# Altium project HHO_DRIVE_V1.PrjPCB
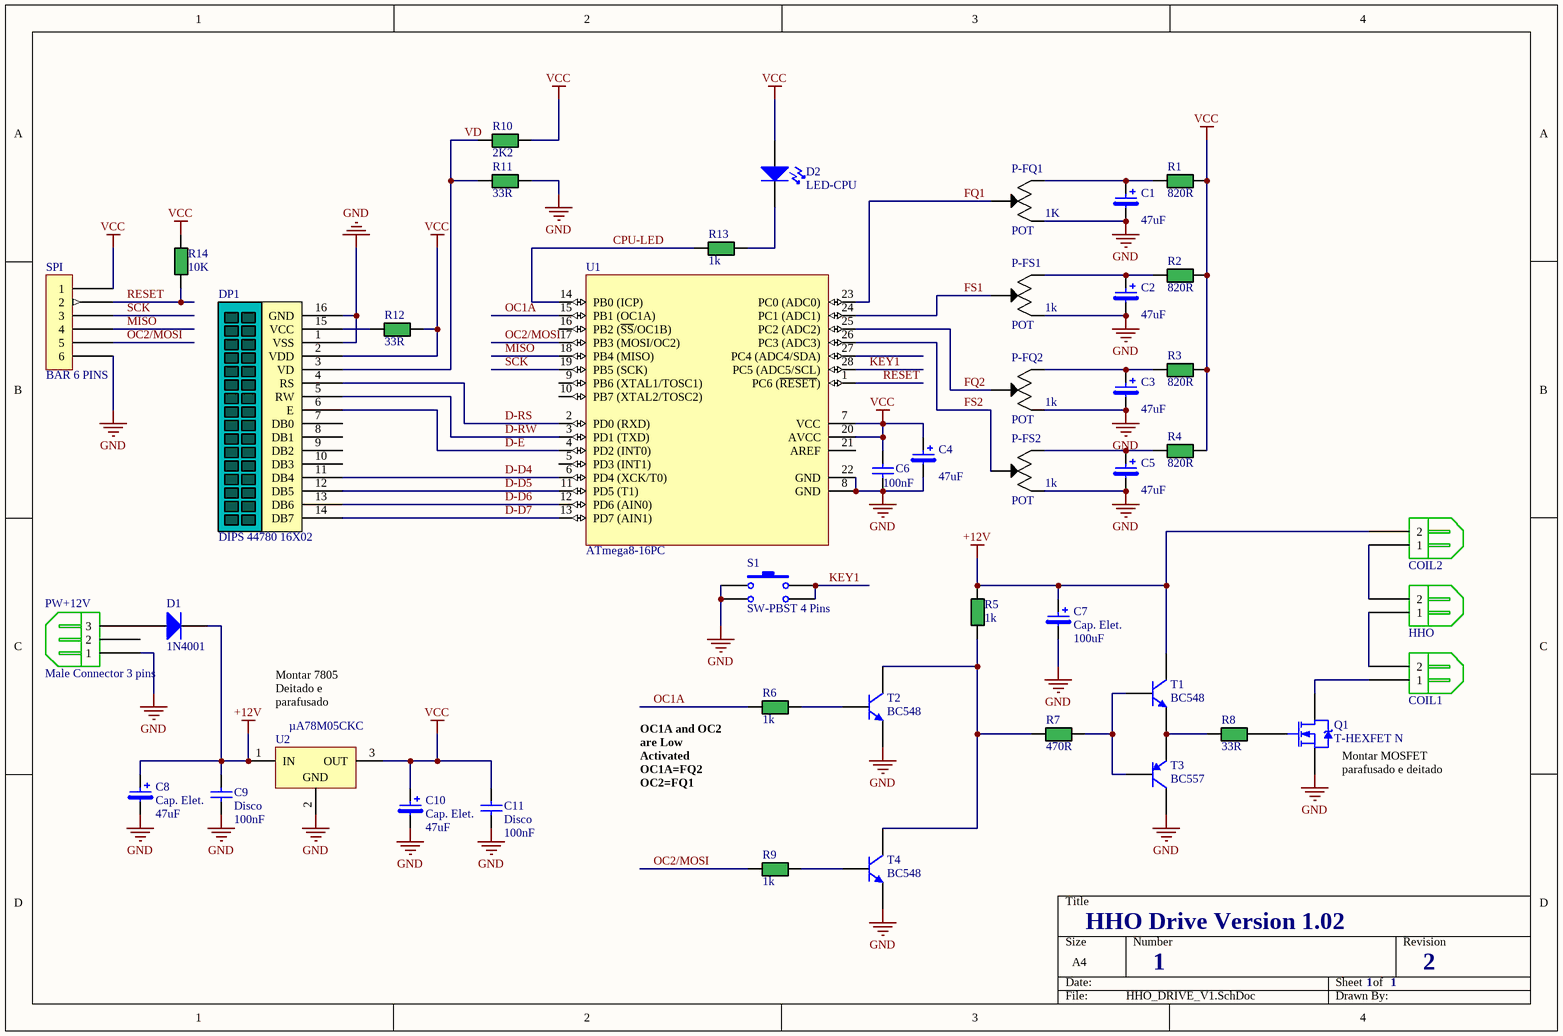
[diagram p0: HHO_DRIVE_V1.SchDoc]
1 sheet, 45 parts. Net scope: global (net labels, ports and power ports of the same name join across sheets).
Board file: HHO_DRIVE_V1.PcbDoc

## Sheet HHO_DRIVE_V1.SchDoc: HHO DIGITAL DRIVE V1.0
size A4; DocumentNumber: 1; Revision: 7; SheetNumber: 1; SheetTotal: 1; ProjectName: HHO DRIVE

### Parts
C1  value 47uF  [CAP ELE RAD 11mm H]  (hidden comment: Cap. Elet.)
C2  value 47uF  [CAP ELE RAD 11mm H]  (hidden comment: Cap. Elet.)
C3  value 47uF  [CAP ELE RAD 11mm H]  (hidden comment: Cap. Elet.)
C4  value 47uF  [CAP ELE RAD 11mm H]  (hidden comment: Cap. Elet.)
C5  value 47uF  [CAP ELE RAD 11mm H]  (hidden comment: Cap. Elet.)
C6  value 100nF  [CAP CER DISK 5MM]  (hidden comment: Disco)
C7  Cap. Elet.  value 100uF  [CAP ELE RAD 11mm H]
C8  Cap. Elet.  value 47uF  [CAP ELE RAD 11mm H]
C9  Disco  value 100nF  [CAP CER DISK 5MM]
C10  Cap. Elet.  value 47uF  [CAP ELE RAD 11mm H]
C11  Disco  value 100nF  [CAP CER DISK 5MM]
COIL1  Male Connector 2 pins  [BR102A]  (value not drawn)
COIL2  Male Connector 2 pins  [BR102A]  (value not drawn)
D1  1N4001  [DO-41]
D2  LED-CPU  [LED Red 3mm]
DP1  DIPS 44780 16X02  [Display 44780 16x02 com conector]
HHO  Male Connector 2 pins  [BR102A]  (value not drawn)
P-FQ1  POT  value 1K  [POT 200MIL/400MIL]
P-FQ2  POT  value 1k  [POT 200MIL/400MIL]
P-FS1  POT  value 1k  [POT 200MIL/400MIL]
P-FS2  POT  value 1k  [POT 200MIL/400MIL]
PW+12V  Male Connector 3 pins  [BR103A]
Q1  T-HEXFET N  [TO218 - DEITADO]
R1  value 820R  [RES 300 CR25]  (hidden comment: Resistor Generic)
R2  value 820R  [RES 300 CR25]  (hidden comment: Resistor Generic)
R3  value 820R  [RES 300 CR25]  (hidden comment: Resistor Generic)
R4  value 820R  [RES 300 CR25]  (hidden comment: Resistor Generic)
R5  value 1k  [RES 300 CR25]  (hidden comment: Resistor Generic)
R6  value 1k  [RES 300 CR25]  (hidden comment: Resistor Generic)
R7  value 470R  [RES 300 CR25]  (hidden comment: Resistor Generic)
R8  value 33R  [RES 300 CR25]  (hidden comment: Resistor Generic)
R9  value 1k  [RES 300 CR25]  (hidden comment: Resistor Generic)
R10  value 2K2  [RES 300 CR25]  (hidden comment: Resistor Generic)
R11  value 33R  [RES 300 CR25]  (hidden comment: Resistor Generic)
R12  value 33R  [RES 300 CR25]  (hidden comment: Resistor Generic)
R13  value 1k  [RES 300 CR25]  (hidden comment: Resistor Generic)
R14  value 10K  [RES 300 CR25]  (hidden comment: Resistor Generic)
S1  SW-PBST 4 Pins  [SW-PBST 4 Pins - SKHH 17 mm]
SPI  BAR 6 PINS  [HEADER BAR 6 PINS]
T1  value BC548  [TO-92 - Large]  (hidden comment: Transistor)
T2  value BC548  [TO-92 - Large]  (hidden comment: Transistor)
T3  value BC557  [TO-92 - Large]  (hidden comment: Transistor)
T4  value BC548  [TO-92 - Large]  (hidden comment: Transistor)
U1  ATmega8-16PC  [28P3]
U2  µA78M05CKC  [KC03 - Deitado]

### Nets
+12V: C7.1 C8.1 C9.2 COIL2.2 D1.2(K) R5.2 T1.3(C) U2.1(IN)
GND: C1.2 C2.2 C3.2 C4.2 C5.2 C6.1 C7.2 C8.2 C9.1 C10.2 C11.1 DP1.1(VSS) DP1.16(GND) P-FQ1.1 P-FQ2.1 P-FS1.1 P-FS2.1 PW+12V.1 Q1.3(S) R11.2 S1.1 S1.2 SPI.6 T2.1(E) T3.3(C) T4.1(E) U1.8(GND) U1.22(GND) U2.2(GND)
VCC: C4.1 C6.2 C10.1 C11.2 D2.A DP1.2(VDD) R1.2 R2.2 R3.2 R4.2 R10.2 R12.2 R14.2 SPI.1 U1.7(VCC) U1.20(AVCC) U2.3(OUT)
CPU-LED: R13.1 U1.14(PB0_(ICP))
D-D4: DP1.11(DB4) U1.6(PD4_(XCK/T0))
D-D5: DP1.12(DB5) U1.11(PD5_(T1))
D-D6: DP1.13(DB6) U1.12(PD6_(AIN0))
D-D7: DP1.14(DB7) U1.13(PD7_(AIN1))
D-E: DP1.6(E) U1.4(PD2_(INT0))
D-RS: DP1.4(RS) U1.2(PD0_(RXD))
D-RW: DP1.5(RW) U1.3(PD1_(TXD))
FQ1: P-FQ1.2 U1.23(PC0_(ADC0))
FQ2: P-FQ2.2 U1.25(PC2_(ADC2))
FS1: P-FS1.2 U1.24(PC1_(ADC1))
FS2: P-FS2.2 U1.26(PC3_(ADC3))
KEY1: S1.3 S1.4 U1.28(PC5_(ADC5/SCL))
MISO: SPI.4 U1.18(PB4_(MISO))
OC1A: R6.1 U1.15(PB1_(OC1A))
OC2/MOSI: R9.1 SPI.5 U1.17(PB3_(MOSI/OC2))
RESET: R14.1 SPI.2 U1.1(PC6_(~{RESET}))
SCK: SPI.3 U1.19(PB5_(SCK))
VD: DP1.3(VD) R10.1 R11.1
NetC1_1: C1.1 P-FQ1.3 R1.1
NetC2_1: C2.1 P-FS1.3 R2.1
NetC3_1: C3.1 P-FQ2.3 R3.1
NetC5_1: C5.1 P-FS2.3 R4.1
NetCOIL1_1: COIL1.1 Q1.2(D)
NetCOIL1_2: COIL1.2 HHO.1
NetCOIL2_1: COIL2.1 HHO.2
NetD1_1: D1.1(A) PW+12V.3
NetD2_K: D2.K R13.2
NetDP1_15: DP1.15(VCC) R12.1
NetQ1_1: Q1.1(G) R8.2
NetR5_1: R5.1 R7.1 T2.3(C) T4.3(C)
NetR6_2: R6.2 T2.2(B)
NetR7_2: R7.2 T1.2(B) T3.2(B)
NetR8_1: R8.1 T1.1(E) T3.1(E)
NetR9_2: R9.2 T4.2(B)

Not connected (* = marked no-connect by the designer): DP1 7(DB0) 8(DB1) 9(DB2) 10(DB3); PW+12V 2; U1 5(PD3_(INT1)) 9(PB6_(XTAL1/TOSC1)) 10(PB7_(XTAL2/TOSC2)) 16(PB2_(~{SS}/OC1B)) 21(AREF) 27(PC4_(ADC4/SDA))

### Notes on the sheet
- Montar 7805 Deitado e parafusado
- (near R6) OC1A and OC2 are Low Activated
  OC1A=FQ2
  OC2=FQ1
- (near Q1) Montar MOSFET parafusado e deitado
- HHO Drive Version 1.02
- 1
- 1      1
- 2
- Title
- Size:
- Date:
- A4
- Number:
- Time:
- Revision:
- Sheet
- of
- File:

### Library data of the parts
C1-C5 C7 C8 C10 = CAP_RADIAL_ELETROLITICO: Capacitor Radial Eletrolitico
C6 C9 C11 = CAP_DISCO: SMD Capacitor 1210 size
COIL1 COIL2 HHO = Male Con 2 Pin
D1 = Diode 1N4001: 1 Amp General Purpose Rectifier; Published: 8-Jun-2000; LatestRevisionDate: 17-Jul-2002; LatestRevisionNote: Re-released for DXP Platform.; DatasheetDocument: 1998; PackageDocument: Aug-1999; PackageReference: DO-41; Publisher: Altium Limited; Code_JEDEC: DO-204-AL; ComponentLink1Description: Manufacturer Link; ComponentLink1URL: http://www.fairchildsemi.com/; ComponentLink2Description: Datasheet; ComponentLink2URL: http://www.fairchildsemi.com/ds/1N%2F1N4001.pdf
D2 = LED
DP1 = Display 44780 16x02 com conector 16 pinos
P-FQ1 P-FQ2 P-FS1 P-FS2 = POT: Potenciometer 3 pins
PW+12V = Male Con 3 Pin
Q1 = T-HEXFET N: HEXFET Power MOSFET
R1-R14 = Resistor Generic: Generic Resistor
S1 = SW-PBST 4 Pins SKHH: Published: 24-Mar-1999; LatestRevisionDate: 17-Jul-2002; LatestRevisionNote: Re-released for DXP Platform.; PackageReference: SPST-2; Publisher: Altium Limited
SPI = HEADER BAR  6 PINS: .100 Inch AMPMODU Headers 1-826629-0 (Tyco)
T1 T2 T4 = T-NPN: General Bipolar Transistor NPN
T3 = T-PNP: General Bipolar Transistor NPN
U1 = ATmega8-16PC: 8-Bit AVR Microcontroller with 8K Bytes of In-System Programmable Flash Memory
U2 = µA78M05CKC: Positive-Voltage Regulator; Note: Pin 2 is electrically connected to TAB.; Published: 15-Apr-2002; DatasheetVersion: Jul-1999; PackageVersion: Sep-1995; PackageReference: KC03; Publisher: Altium Limited; PackageDescription: TO, Thru-Hole, Vertical, Heatsink Mounted; 3 In-Line Leads; Pitch 2.54 mm; ComponentLink1Description: Manufacturer Link; ComponentLink1URL: http://www.ti.com/; ComponentLink2Description: Datasheet; ComponentLink2URL: http://www-s.ti.com/sc/ds/ua78m05.pdf